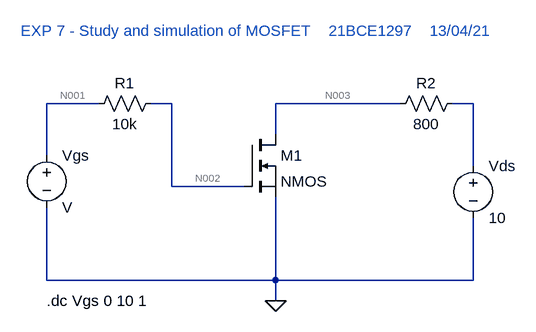
[diagram p0: schematic Exp7_Part1.asc]
Exp7_Part1.asc, the LTspice schematic file:
Version 4
SHEET 1 880 680
WIRE -32 32 -112 32
WIRE 80 32 48 32
WIRE 432 32 240 32
WIRE 544 32 512 32
WIRE 240 80 240 32
WIRE -112 112 -112 32
WIRE 544 128 544 32
WIRE 80 160 80 32
WIRE 192 160 80 160
WIRE -112 304 -112 192
WIRE 240 304 240 176
WIRE 240 304 -112 304
WIRE 544 304 544 208
WIRE 544 304 240 304
WIRE 240 336 240 304
FLAG 240 336 0
SYMBOL nmos 192 80 R0
SYMATTR InstName M1
SYMBOL res 64 16 R90
WINDOW 0 0 56 VBottom 2
WINDOW 3 32 56 VTop 2
SYMATTR InstName R1
SYMATTR Value 10k
SYMBOL res 528 16 R90
WINDOW 0 0 56 VBottom 2
WINDOW 3 32 56 VTop 2
SYMATTR InstName R2
SYMATTR Value 800
SYMBOL voltage -112 96 R0
SYMATTR InstName Vgs
SYMBOL voltage 544 112 R0
SYMATTR InstName Vds
SYMATTR Value 10
TEXT -112 336 Left 2 !.dc Vgs 0 10 1
TEXT -152 -80 Left 2 ;EXP 7 - Study and simulation of MOSFET    21BCE1297    13/04/21

The netlist it stands for:
* Exp7_Part1.asc
M1 N003 N002 0 0 NMOS
R1 N002 N001 10k
R2 N004 N003 800
Vgs N001 0 V
Vds N004 0 10
.model NMOS NMOS
.model PMOS PMOS
.lib standard.mos
.dc Vgs 0 10 1
* EXP 7 - Study and simulation of MOSFET    21BCE1297    13/04/21
.backanno
.end

* Results of the author's LTspice run, read from the files saved beside the schematic
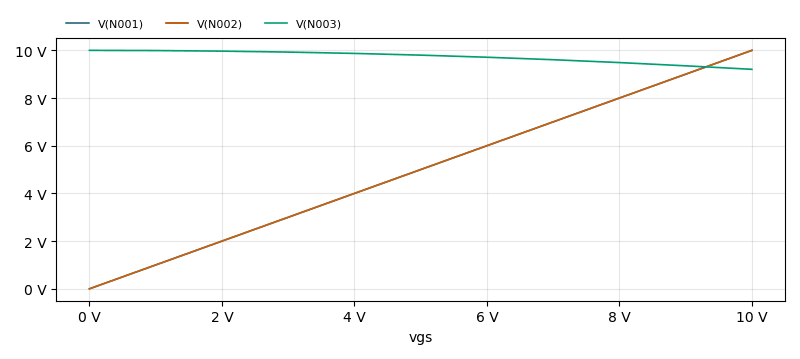
[diagram p1: DC transfer characteristic of Exp7_Part1.asc, plotted from the saved traces]
* DC transfer characteristic, 1 run:
*   V(N001): 0 V at vgs=0 V, 10 V at vgs=10 V, min 0 V, max 10 V
*   V(N002): 0 V at vgs=0 V, 10 V at vgs=10 V, min 0 V, max 10 V
*   V(N003): 10 V at vgs=0 V, 9.205 V at vgs=10 V, min 9.205 V, max 10 V